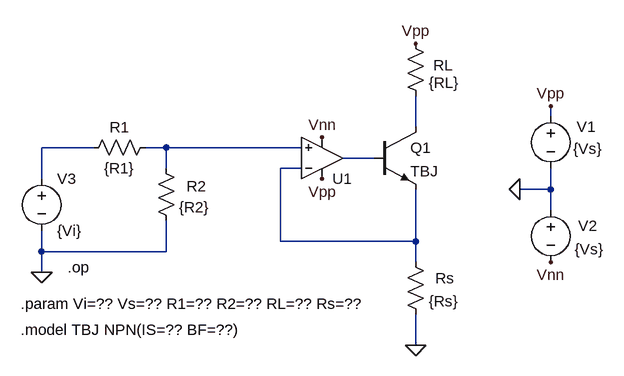
[diagram p0: schematic COMB08opFig.asc]
COMB08opFig.asc, the LTspice schematic file:
Version 4
SHEET 1 2180 1076
WIRE 1232 -160 1232 -176
WIRE 1024 -144 1024 -192
WIRE 528 -112 448 -112
WIRE 640 -112 608 -112
WIRE 848 -112 640 -112
WIRE 960 -96 912 -96
WIRE 640 -80 640 -112
WIRE 848 -80 816 -80
WIRE 448 -64 448 -112
WIRE 1232 -48 1232 -80
WIRE 1232 -48 1184 -48
WIRE 1232 -16 1232 -48
WIRE 816 32 816 -80
WIRE 1024 32 1024 -48
WIRE 1024 32 816 32
WIRE 448 48 448 16
WIRE 640 48 640 0
WIRE 640 48 448 48
WIRE 1024 64 1024 32
WIRE 448 80 448 48
WIRE 1024 192 1024 144
FLAG 1232 -176 Vpp
FLAG 1184 -48 0
FLAG 1232 64 Vnn
FLAG 1024 192 0
FLAG 880 -64 Vpp
FLAG 880 -128 Vnn
FLAG 448 80 0
FLAG 1024 -272 Vpp
SYMBOL voltage 1232 -176 R0
WINDOW 123 0 0 Left 0
WINDOW 39 0 0 Left 0
WINDOW 0 40 32 Left 2
WINDOW 3 35 66 Left 2
SYMATTR InstName V1
SYMATTR Value {Vs}
SYMBOL voltage 1232 -32 R0
WINDOW 123 0 0 Left 0
WINDOW 39 0 0 Left 0
WINDOW 0 42 40 Left 2
WINDOW 3 37 76 Left 2
SYMATTR InstName V2
SYMATTR Value {Vs}
SYMBOL res 624 -96 R0
WINDOW 0 47 43 Left 2
SYMATTR InstName R2
SYMATTR Value {R2}
SYMBOL npn 960 -144 R0
SYMATTR InstName Q1
SYMATTR Value TBJ
SYMBOL res 512 -96 R270
WINDOW 0 32 56 VTop 2
WINDOW 3 0 56 VBottom 2
SYMATTR InstName R1
SYMATTR Value {R1}
SYMBOL OpAmps\\UniversalOpAmp2 880 -96 M180
SYMATTR InstName U1
SYMBOL voltage 448 -80 R0
WINDOW 123 0 0 Left 0
WINDOW 39 0 0 Left 0
SYMATTR InstName V3
SYMATTR Value {Vi}
SYMBOL res 1008 48 R0
WINDOW 0 46 41 Left 2
SYMATTR InstName Rs
SYMATTR Value {Rs}
SYMBOL res 1008 -288 R0
WINDOW 0 43 49 Left 2
SYMATTR InstName RL
SYMATTR Value {RL}
TEXT 488 72 Left 2 !.op
TEXT 416 128 Left 2 !.param Vi=?? Vs=?? R1=?? R2=?? RL=?? Rs=??
TEXT 416 168 Left 2 !.model TBJ NPN(IS=?? BF=??)

The netlist it stands for:
* COMB08opFig.asc
V1 Vpp 0 {Vs}
V2 0 Vnn {Vs}
R2 N003 0 {R2}
Q1 N001 N004 N005 0 TBJ
R1 N002 N003 {R1}
XU1 N003 N005 Vpp Vnn N004 level2 Avol=1Meg GBW=10Meg Slew=10Meg Ilimit=25m Rail=0 Vos=0 En=0 Enk=0 In=0 Ink=0 Rin=500Meg  ; pins In+ In- V+ V- OUT
V3 N002 0 {Vi}
Rs N005 0 {Rs}
RL Vpp N001 {RL}
.model NPN NPN
.model PNP PNP
.lib standard.bjt
.op
.param Vi=?? Vs=?? R1=?? R2=?? RL=?? Rs=??
.model TBJ NPN(IS=?? BF=??)
.lib UniversalOpAmp2.lib
.backanno
.end